# EAGLE design ep2c5_02 (EAGLE 7.2.0)
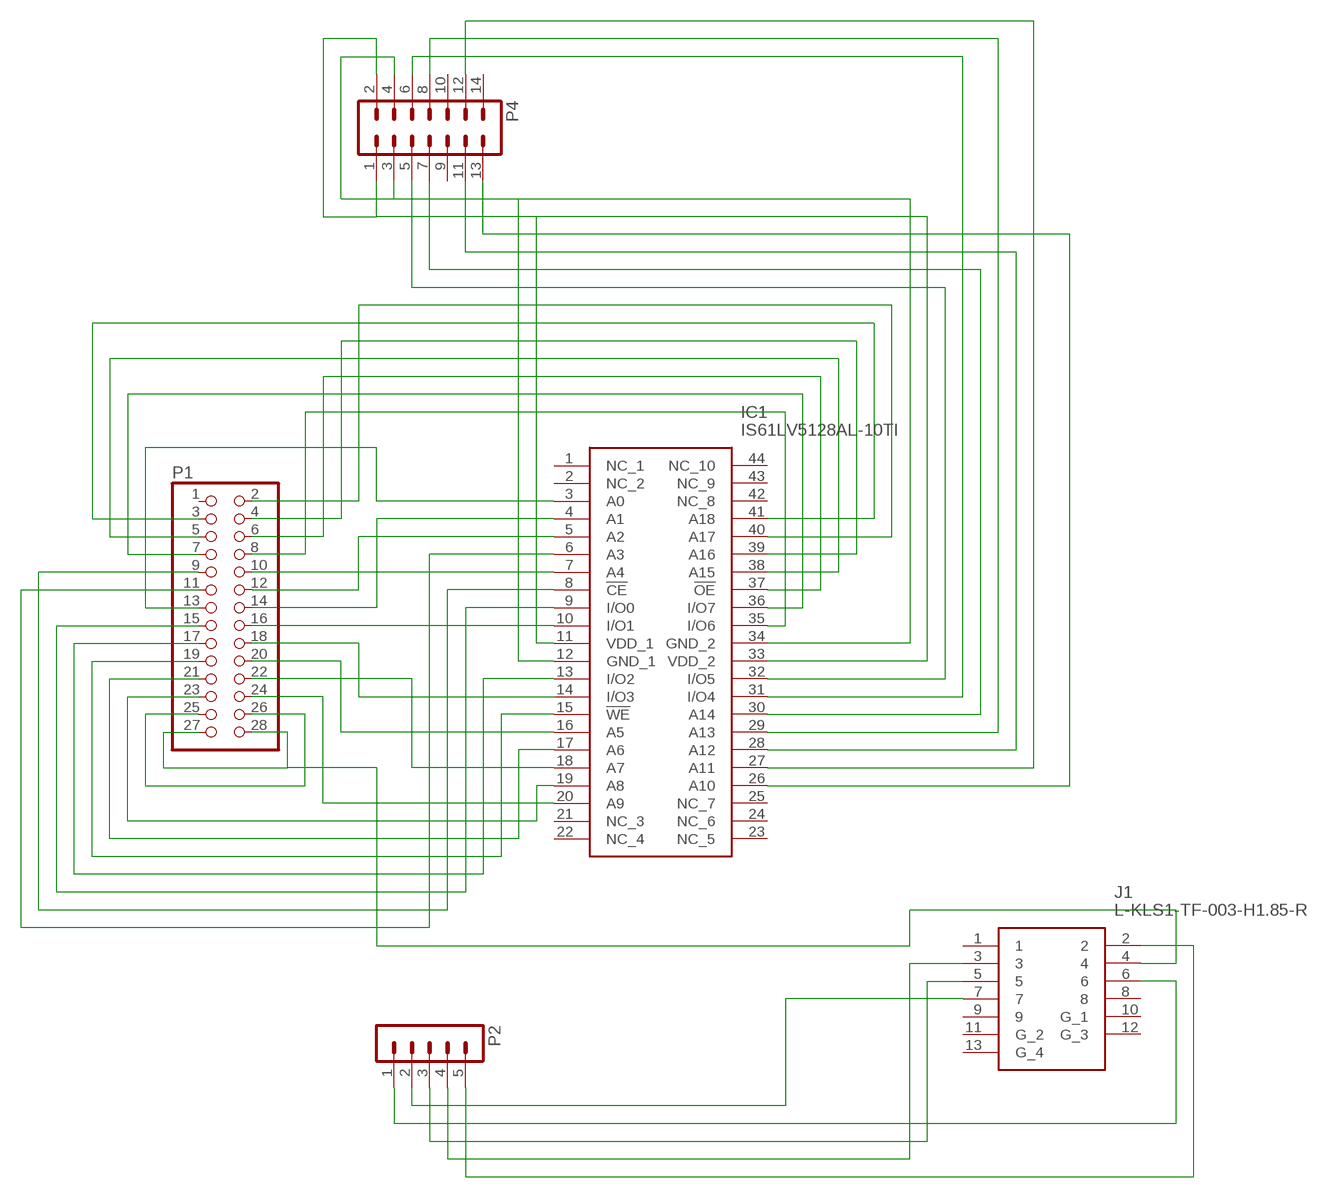
[diagram p0: schematic, sheet 1]

## Parts
IC1  IS61LV5128AL-10TI  [SOP80P1176X120-44N]
J1  L-KLS1-TF-003-H1.85-R  [L-KLS1-TF-003-H1.85-R]
P1  PINHD-2X14  [2X14]
P2  MA05-1  [MA05-1]
P4  MA07-2  [MA07-2]

## Nets
N$1: J1.4 P1.27 P1.28
N$2: IC1.20(A9) P1.24
N$3: P1.25 P1.26
N$4: IC1.19(A8) P1.23
N$5: IC1.18(A7) P1.22
N$6: IC1.17(A6) P1.21
N$7: IC1.16(A5) P1.20
N$8: IC1.15(!WE) P1.19
N$9: IC1.14(I/O3) P1.18
N$10: IC1.13(I/O2) P1.17
N$11: IC1.10(I/O1) P1.16
N$12: IC1.9(I/O0) P1.15
N$13: IC1.12(GND_1) IC1.34(GND_2) P4.3 P4.4
N$14: IC1.8(!CE) P1.9
N$15: IC1.7(A4) P1.10
N$16: IC1.6(A3) P1.11
N$17: IC1.4(A1) P1.14
N$18: IC1.3(A0) P1.13
N$19: IC1.35(I/O6) P1.8
N$20: IC1.36(I/O7) P1.7
N$21: IC1.11(VDD_1) IC1.33(VDD_2) P4.1 P4.2
N$22: IC1.37(!OE) P1.6
N$23: IC1.38(A15) P1.5
N$24: IC1.39(A16) P1.4
N$25: IC1.41(A18) P1.3
N$26: IC1.40(A17) P1.2
N$27: IC1.32(I/O5) P4.5
N$28: IC1.31(I/O4) P4.6
N$29: IC1.30(A14) P4.7
N$30: IC1.29(A13) P4.8
N$31: IC1.28(A12) P4.11
N$32: IC1.27(A11) P4.12
N$33: IC1.26(A10) P4.13
N$34: J1.7 P2.2
N$35: J1.6 P2.1
N$36: J1.5 P2.3
N$37: J1.3 P2.4
N$38: J1.2 P2.5
N$39: IC1.5(A2) P1.12
Unconnected: IC1.1(NC_1) IC1.2(NC_2) IC1.21(NC_3) IC1.22(NC_4) IC1.23(NC_5) IC1.24(NC_6) IC1.25(NC_7) IC1.42(NC_8) IC1.43(NC_9) IC1.44(NC_10) J1.1 J1.8 J1.9 J1.10(G_1) J1.11(G_2) J1.12(G_3) J1.13(G_4) P1.1 P4.9 P4.10 P4.14

## Library data of the parts
IC1 = IS61LV5128AL-10TI:IS61LV5128AL-10TI: SRAM 4Mb 512Kx8 10ns Async SRAM 3.3v Source: Datasheet <http://www.issi.com/WW/pdf/61LV5128AL.pdf>; DESCRIPTION: SRAM 4Mb 512Kx8 10ns Async SRAM 3.3v; HEIGHT: 1.2mm; MANUFACTURER_NAME: Integrated Silicon Solution Inc.; MANUFACTURER_PART_NUMBER: IS61LV5128AL-10TI; MOUSER_PART_NUMBER: 870IS61LV5128AL10TI; MOUSER_PRICE-STOCK: https://www.mouser.com/Search/Refine.aspx?Keyword=870IS61LV5128AL10TI
J1 = L-KLS1-TF-003-H1.85-R:L-KLS1-TF-003-H1.85-R: Micro SD Card Connector Source: Datasheet <https://img.ozdisan.com/ETicaret_Dosya/476392_7149645.pdf>; DESCRIPTION: Micro SD Card Connector; HEIGHT: mm; MANUFACTURER_NAME: KLS Electronic; MANUFACTURER_PART_NUMBER: L-KLS1-TF-003-H1.85-R
P1 = pinhead:PINHD-2X14: PIN HEADER
P2 = con-lstb:MA05-1: PIN HEADER; OC_FARNELL: unknown; OC_NEWARK: unknown
P4 = con-lstb:MA07-2: PIN HEADER; OC_FARNELL: unknown; OC_NEWARK: unknown

## Net classes
0 default: width 0.3 mm

## Board
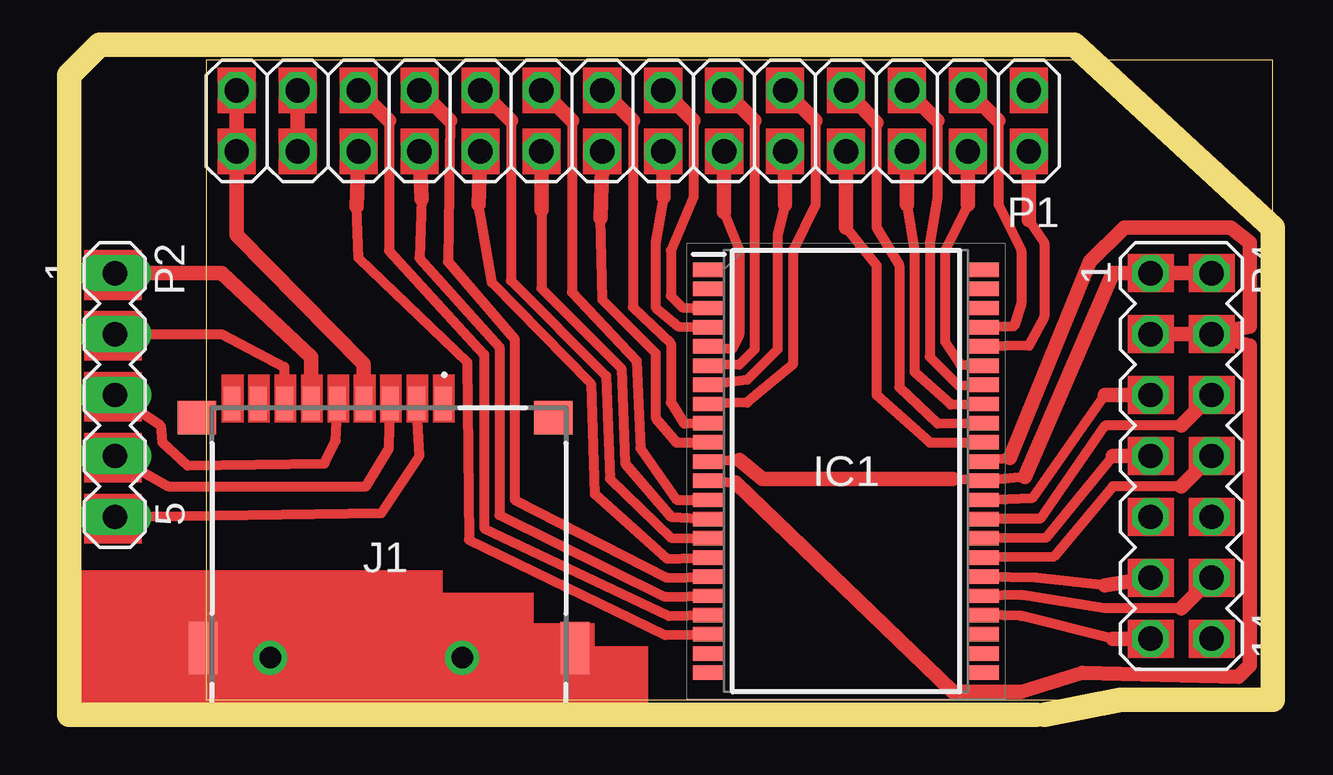
[diagram p1: board, top side]

Size 44.45 x 26.67 mm. Coordinates in mm from the lower left corner, seen from the top.
Outline: 0,26.67 0,0 44.45,0 44.45,26.67 0,26.67
Copper layers (1*16): Top 0.035mm / dielectric 1.5mm / Bottom 0.035mm
Design rules "default": minimum track width 10mil, minimum drill 24mil, track to track 8mil, track to pad 8mil, pad to pad 8mil, via to via 8mil, smd to smd 8mil, copper to edge 40mil, drill to drill 8mil, minimum pad ring 10mil, minimum via ring 8mil, stop-mask expansion 4mil, vias tented up to drill 0mil, thermal gap 10mil
Milling: 8 lines

### Footprints (pad centres in the part's own frame; a part is rotated, then mirrored left to right if it is on the bottom)
SOP80P1176X120-44N = smd 1.295 x 0.6: 1 -5.728,8.4; 2 -5.728,7.6; 3 -5.728,6.8; 4 -5.728,6; 5 -5.728,5.2; 6 -5.728,4.4; 7 -5.728,3.6; 8 -5.728,2.8; 9 -5.728,2; 10 -5.728,1.2; 11 -5.728,0.4; 12 -5.728,-0.4; 13 -5.728,-1.2; 14 -5.728,-2; 15 -5.728,-2.8; 16 -5.728,-3.6; 17 -5.728,-4.4; 18 -5.728,-5.2; 19 -5.728,-6; 20 -5.728,-6.8; 21 -5.728,-7.6; 22 -5.728,-8.4; 23 5.728,-8.4; 24 5.728,-7.6; 25 5.728,-6.8; 26 5.728,-6; 27 5.728,-5.2; 28 5.728,-4.4; 29 5.728,-3.6; 30 5.728,-2.8; 31 5.728,-2; 32 5.728,-1.2; 33 5.728,-0.4; 34 5.728,0.4; 35 5.728,1.2; 36 5.728,2; 37 5.728,2.8; 38 5.728,3.6; 39 5.728,4.4; 40 5.728,5.2; 41 5.728,6; 42 5.728,6.8; 43 5.728,7.6; 44 5.728,8.4
L-KLS1-TF-003-H1.85-R = smd 0.7 x 1.4: 1 2.25,10.6; 2 1.15,10.6; 3 0.05,10.6; 4 -1.05,10.6; 5 -2.15,10.6; 6 -3.25,10.6; 7 -4.35,10.6; 8 -5.45,10.6; 9 -6.55,10.6 | smd 1.6 x 1.4: 10 -8,10; 13 6.85,10 | smd 1.2 x 2.2: 11 -7.75,0.4; 12 7.75,0.4 | drill 0.9 pad 1.4: 14 3.05,0; 15 -4.95,0
2X14 = drill 1.016 octagon: 1 -16.51,-1.27; 2 -16.51,1.27; 3 -13.97,-1.27; 4 -13.97,1.27; 5 -11.43,-1.27; 6 -11.43,1.27; 7 -8.89,-1.27; 8 -8.89,1.27; 9 -6.35,-1.27; 10 -6.35,1.27; 11 -3.81,-1.27; 12 -3.81,1.27; 13 -1.27,-1.27; 14 -1.27,1.27; 15 1.27,-1.27; 16 1.27,1.27; 17 3.81,-1.27; 18 3.81,1.27; 19 6.35,-1.27; 20 6.35,1.27; 21 8.89,-1.27; 22 8.89,1.27; 23 11.43,-1.27; 24 11.43,1.27; 25 13.97,-1.27; 26 13.97,1.27; 27 16.51,-1.27; 28 16.51,1.27
MA05-1 = drill 1.016 long: 1 -5.08,0; 2 -2.54,0; 3 0,0; 4 2.54,0; 5 5.08,0
MA07-2 = drill 1.016 octagon: 1 -7.62,-1.27; 2 -7.62,1.27; 3 -5.08,-1.27; 4 -5.08,1.27; 5 -2.54,-1.27; 6 -2.54,1.27; 7 0,-1.27; 8 0,1.27; 9 2.54,-1.27; 10 2.54,1.27; 11 5.08,-1.27; 12 5.08,1.27; 13 7.62,-1.27; 14 7.62,1.27

### Placement (x,y rotation side)
IC1  26.67,9.53 0 top
J1  7.62,1.75 0 top
P1  17.78,24.13 180 top
P2  -3.81,12.7 270 top  (outside the outline)
P4  40.64,10.16 270 top

### Tracks (layer width: path | path; a pad name or v marks a point on that pad's centre or on a via)
N$1
  Top 0.61: P1.27 P1.28 1.27,19.37 6.55,13.99 J1.4
N$2
  Top 0.406: IC1.20 19.13,2.7 10.95,6.67 10.87,14.07 6.35,18.41 6.27,20.56
  Top 0.61: 6.27,20.56 P1.24
N$3
  Top 0.61: P1.25 P1.26
N$4
  Top 0.406: 7.62,24.13 7.62,18.73 11.59,14.39 11.59,7.14 19.29,3.49 IC1.19
  Top 0.61: P1.23 7.62,24.13
N$5
  Top 0.406: IC1.18 19.13,4.29 12.22,7.7 12.22,14.71 8.89,18.41 8.97,20.88
  Top 0.61: P1.22 8.97,20.88
N$6
  Top 0.406: 10.16,24.13 10.08,18.26 12.86,15.03 12.86,8.33 19.21,5.08 IC1.17
  Top 0.61: P1.21 10.16,24.13
N$7
  Top 0.406: IC1.16 19.21,5.87 16.19,8.57 16.03,13.18 11.91,17.38 11.35,20.64
  Top 0.61: 11.35,20.64 P1.20
N$8
  Top 0.406: 12.7,24.13 12.7,17.46 16.67,13.49 16.83,9.21 19.37,6.75 IC1.15
  Top 0.61: P1.19 12.7,24.13
N$9
  Top 0.406: IC1.14 19.37,7.62 17.46,9.84 17.3,13.81 13.97,17.15 13.97,20.4
  Top 0.61: P1.18 13.97,20.4
N$10
  Top 0.406: 15.24,24.13 15.24,16.99 17.94,14.13 18.1,10.48 19.61,8.33 IC1.13
  Top 0.61: P1.17 15.24,24.13
N$11
  Top 0.406: IC1.10 19.61,10.72 18.73,11.75 18.73,14.45 16.51,16.67 16.43,20.08
  Top 0.61: 16.43,20.08 P1.16
N$12
  Top 0.406: 17.78,24.13 17.78,16.35 19.37,14.84 19.37,12.38 19.92,11.51 IC1.9
  Top 0.61: P1.15 17.78,24.13
N$13
  Top 0.406: 33.5,10.08 IC1.34 | IC1.12 22.07,9.05
  Top 0.61: 33.5,10.08 36.83,18.26 38.26,19.69 42.7,19.69 43.5,19.05 43.5,15.56 P4.4 | P4.4 P4.3 | 22.07,9.05 31.12,0.32 33.97,0.32 36.51,1.11 43.02,0.95 43.5,1.43 43.5,14.76 P4.4
N$14
  Top 0.406: 25.4,24.13 25.4,20.64 24.45,18.73 24.45,13.97 22.54,12.38 IC1.8
  Top 0.61: P1.9 25.4,24.13
N$15
  Top 0.406: 24.13,20.64 23.81,19.37 23.81,14.61 22.54,13.34 IC1.7
  Top 0.61: P1.10 24.13,20.64
N$16
  Top 0.406: 22.86,24.13 22.86,14.61 22.23,13.97 IC1.6
  Top 0.61: P1.11 22.86,24.13
N$17
  Top 0.406: 19.05,20.96 18.73,19.05 18.73,16.35 19.69,15.56 IC1.4
  Top 0.61: P1.14 19.05,20.96
N$18
  Top 0.406: 20.32,24.13 20.32,20.96 19.37,18.73 19.37,16.83 19.84,16.35 IC1.3
  Top 0.61: P1.13 20.32,24.13
N$19
  Top 0.406: 26.67,19.69 27.94,18.1 27.94,12.7 30.16,10.72 IC1.35
  Top 0.61: P1.8 26.67,19.69
N$20
  Top 0.406: 27.94,24.05 27.94,19.69 28.89,18.1 28.89,13.02 30.48,11.51 IC1.36
  Top 0.61: P1.7 27.94,24.05
N$21
  Top 0.406: 34.13,9.29 IC1.33 31.12,9.21 | 22.23,10 IC1.11
  Top 0.61: 34.13,9.29 37.78,17.78 P4.1 P4.2 | 31.12,9.21 23.18,9.21 22.23,10
N$22
  Top 0.406: 29.21,20.64 29.53,18.73 29.53,13.65 31.04,12.3 IC1.37
  Top 0.61: P1.6 29.21,20.64
N$23
  Top 0.406: 30.48,24.13 30.48,20.96 30.16,19.05 30.16,14.29 31.35,13.1 IC1.38
  Top 0.61: P1.5 30.48,24.13
N$24
  Top 0.406: 31.75,20.64 30.8,18.73 30.8,14.92 31.43,13.97 IC1.39
  Top 0.61: P1.4 31.75,20.64
N$25
  Top 0.406: 33.02,24.13 33.02,20.64 33.97,18.73 33.97,16.51 33.66,15.56 IC1.41
  Top 0.61: P1.3 33.02,24.13
N$26
  Top 0.406: 34.29,20 34.93,19.05 34.93,15.95 34.29,14.76 IC1.40
  Top 0.61: P1.2 34.29,20
N$27
  Top 0.406: IC1.32 34.45,8.41 37.47,12.7
  Top 0.61: 37.47,12.7 P4.5
N$28
  Top 0.406: 40.64,11.43 37.47,11.43 34.77,7.54 IC1.31
  Top 0.61: P4.6 40.64,11.43
N$29
  Top 0.406: 37.78,10.16 35,6.75 IC1.30
  Top 0.61: P4.7 37.78,10.16
N$30
  Top 0.406: 40.64,8.89 37.78,8.89 35.32,5.95 IC1.29
  Top 0.61: P4.8 40.64,8.89
N$31
  Top 0.406: 37.47,4.76 34.61,5.08 IC1.28
  Top 0.61: P4.11 37.47,4.76
N$32
  Top 0.406: 40.64,3.81 37.47,3.81 33.97,4.37 IC1.27
  Top 0.61: P4.12 40.64,3.81
N$33
  Top 0.406: 37.78,2.54 33.97,3.49 IC1.26
  Top 0.61: P4.13 37.78,2.54
N$34
  Top 0.406: P2.2 0.64,15.24 3.25,13.87 J1.7
N$35
  Top 0.61: P2.1 0.64,17.78 4.37,14.29 J1.6
N$36
  Top 0.406: P2.3 -1.9,11.43 -1.83,10.72 -0.79,9.76 4.92,9.84 5.4,10.8 J1.5
N$37
  Top 0.406: P2.4 -1.59,8.89 6.67,8.89 7.62,10.48 J1.3
N$38
  Top 0.406: P2.5 7.3,7.78 8.89,10.16 J1.2
N$39
  Top 0.406: 21.59,20.32 22.23,18.73 22.23,15.24 21.91,14.61 IC1.5
  Top 0.61: P1.12 21.59,20.32
(copper drawn outside any net)
  shapes: Top area x60